# Altium schematic sheet faydalı yük.SchDoc
size A4; SheetNumber: 1; SheetTotal: 1
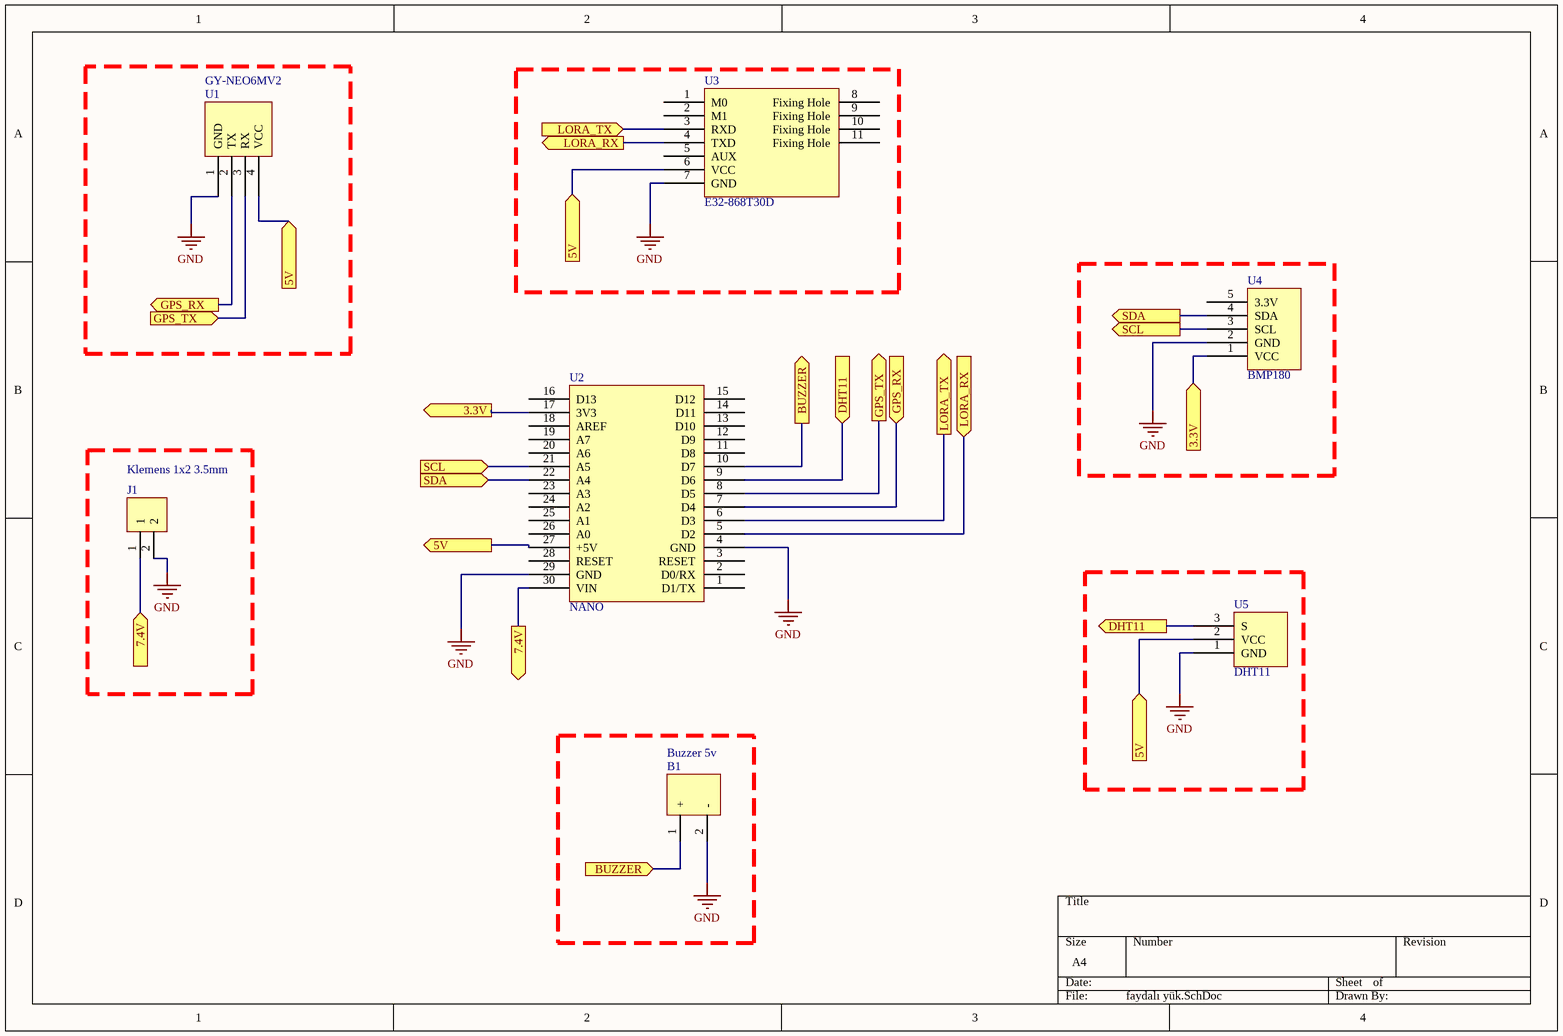
[diagram p0: faydalı yük.SchDoc]

## Parts
B1  Buzzer 5v  [Buzzer 5v]
J1  Klemens 1x2 3.5mm  [Klemens 1x2 - 3.5mm]
U1  GY-NEO6MV2  [GY-NEO6MV2]
U2  NANO  [nano]
U3  E32-868T30D  [E32-868T30D]
U4  BMP180  [BMP180]
U5  DHT11  [DHT11]

## Ports
3.3V (in), 3.3V (out), 5V (in), 5V (out), 7.4V (in), 7.4V (out), BUZZER (in), BUZZER (out), DHT11 (in), DHT11 (out), GPS_RX (in), GPS_RX (out), GPS_TX (in), GPS_TX (out), LORA_RX (in), LORA_RX (out), LORA_TX (in), LORA_TX (out), SCL (in), SCL (out), SDA (in), SDA (out)

## Nets
GND: B1.2(-) J1.2 U1.1(GND) U2.4(GND) U2.29(GND) U3.7(GND) U4.2(GND) U5.1(GND)
3.3V: U2.17(3V3) U4.1(VCC) ; port 3.3V
5V: U1.4(VCC) U2.27(+5V) U3.6(VCC) U5.2(VCC) ; port 5V
7.4V: J1.1 U2.30(VIN) ; port 7.4V
BUZZER: B1.1(+) U2.10(D7) ; port BUZZER
DHT11: U2.9(D6) U5.3(S) ; port DHT11
GPS_RX: U1.2(TX) U2.7(D4) ; port GPS_RX
GPS_TX: U1.3(RX) U2.8(D5) ; port GPS_TX
LORA_RX: U2.5(D2) U3.4(TXD) ; port LORA_RX
LORA_TX: U2.6(D3) U3.3(RXD) ; port LORA_TX
SCL: U2.21(A5) U4.3(SCL) ; port SCL
SDA: U2.22(A4) U4.4(SDA) ; port SDA

Not connected (* = marked no-connect by the designer): U2 1(D1/TX) 2(D0/RX) 3(RESET) 11(D8) 12(D9) 13(D10) 14(D11) 15(D12) 16(D13) 18(AREF) 19(A7) 20(A6) 23(A3) 24(A2) 25(A1) 26(A0) 28(RESET); U3 1(M0) 2(M1) 5(AUX) 8(Fixing_Hole) 9(Fixing_Hole) 10(Fixing_Hole) 11(Fixing_Hole); U4 5(3.3V)